# Altium schematic sheet Bluetooth.SchDoc: Serial to Bluetooth module
size A4
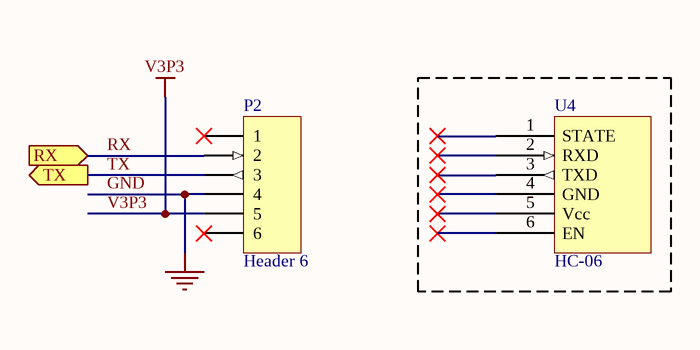
[diagram p0: Bluetooth.SchDoc]

## Parts
P2  Header 6  [Header 6]
U4  HC-06  (mechanical)

## Ports
RX (in), TX (out)

## Nets
GND: P2.4
V3P3: P2.5
RX: P2.2 ; port RX
TX: P2.3 ; port TX

Not connected (* = marked no-connect by the designer): P2 1* 6*; U4 1(STATE)* 2(RXD)* 3(TXD)* 4(GND)* 5(Vcc)* 6(EN)*

## Notes on the sheet
- Title
- Size:
- Date:
- A4
- Number:
- Time:
- Revision:
- Sheet
- of
- File:

## Library data of the parts
P2 = Header 6: Header, 6-Pin; Fabricant: MULTICOMP; Fournisseur: Farnell; RefFournisseur: 1593462; RefFabricant: 2212S-06SG-85
U4 = HC-06: Bluetooth; Fabricant: Wavesen; RefFabricant: HC-06